# Altium schematic sheet muxduino-shield.SchDoc
size A; SheetNumber: 1; SheetTotal: 1
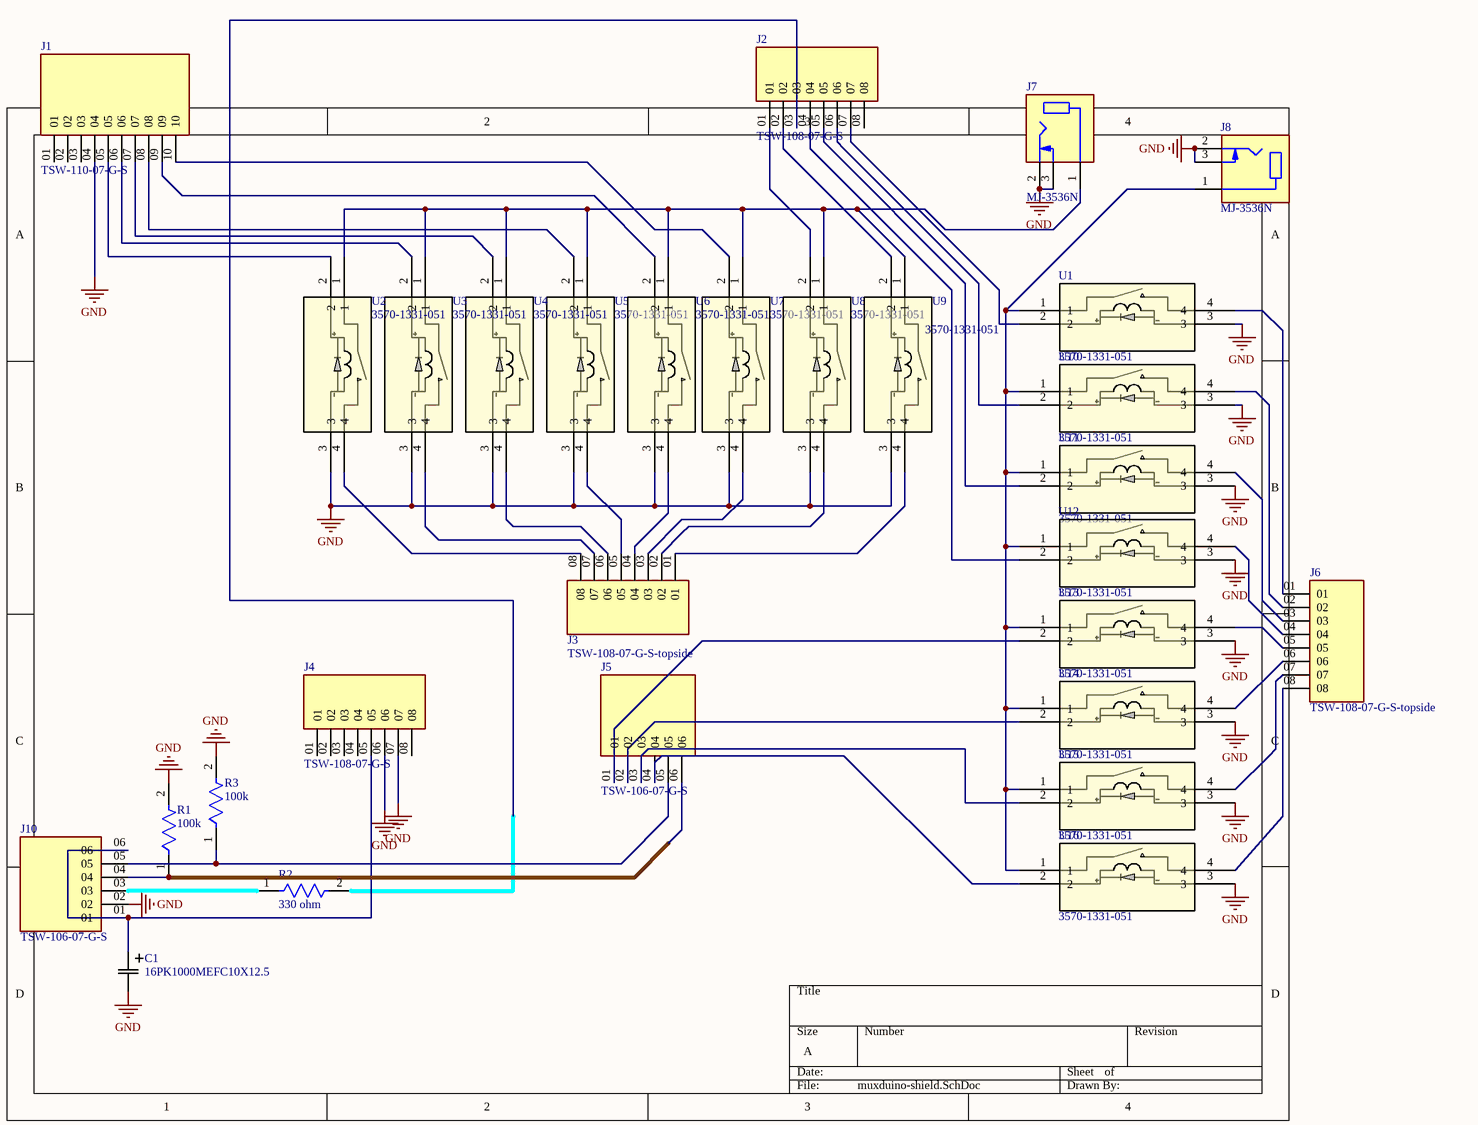
[diagram p0: muxduino-shield.SchDoc]

## Parts
C1  16PK1000MEFC10X12.5  [CAP_PKPZ_10X12P5_LOW_RUB]
J1  TSW-110-07-G-S  [SAMTEC_TSW-110-07-G-S]
J2  TSW-108-07-G-S  [SAMTEC_TSW-108-07-G-S]
J3  TSW-108-07-G-S-topside  [SAMTEC_TSW-108-07-G-S-topside]
J4  TSW-108-07-G-S  [SAMTEC_TSW-108-07-G-S]
J5  TSW-106-07-G-S  [SAMTEC_TSW-106-07-G-S]
J6  TSW-108-07-G-S-topside  [SAMTEC_TSW-108-07-G-S-topside]
J7  MJ-3536N  [CUI_MJ-3536N]
J8  MJ-3536N  [CUI_MJ-3536N]
J10  TSW-106-07-G-S  [SAMTEC_TSW-106-07-G-S]
R1  100k  [FP-RLR07-MFG]
R2  330 ohm  [FP-RLR07-MFG]
R3  100k  [FP-RLR07-MFG]
U1  3570-1331-051  [SIP_3570-1331_COM]
U2  3570-1331-051  [SIP_3570-1331_COM]
U3  3570-1331-051  [SIP_3570-1331_COM]
U4  3570-1331-051  [SIP_3570-1331_COM]
U5  3570-1331-051  [SIP_3570-1331_COM]
U6  3570-1331-051  [SIP_3570-1331_COM]
U7  3570-1331-051  [SIP_3570-1331_COM]
U8  3570-1331-051  [SIP_3570-1331_COM]
U9  3570-1331-051  [SIP_3570-1331_COM]
U10  3570-1331-051  [SIP_3570-1331_COM]
U11  3570-1331-051  [SIP_3570-1331_COM]
U12  3570-1331-051  [SIP_3570-1331_COM]
U13  3570-1331-051  [SIP_3570-1331_COM]
U14  3570-1331-051  [SIP_3570-1331_COM]
U15  3570-1331-051  [SIP_3570-1331_COM]
U16  3570-1331-051  [SIP_3570-1331_COM]

## Nets
GND: C1.2 J1.04 J4.06 J4.07 J7.2 J7.3 J8.2 J8.3 J10.02 R1.2 R3.2 U1.3 U2.3 U3.3 U4.3 U5.3 U6.3 U7.3 U8.3 U9.3 U10.3 U11.3 U12.3 U13.3 U14.3 U15.3 U16.3
NetC1_1: C1.1 J4.05 J10.01 J10.06
NetJ1_05: J1.05 U2.2
NetJ1_06: J1.06 U3.2
NetJ1_07: J1.07 U4.2
NetJ1_08: J1.08 U5.2
NetJ1_09: J1.09 U6.2
NetJ1_10: J1.10 U7.2
NetJ2_01: J2.01 U8.2
NetJ2_02: J2.02 U9.2
NetJ2_03: J2.03 R2.2
NetJ2_04: J2.04 U12.2
NetJ2_05: J2.05 U11.2
NetJ2_06: J2.06 U10.2
NetJ2_07: J2.07 U1.2
NetJ3_01: J3.01 U9.4
NetJ3_02: J3.02 U8.4
NetJ3_03: J3.03 U7.4
NetJ3_04: J3.04 U6.4
NetJ3_05: J3.05 U5.4
NetJ3_06: J3.06 U4.4
NetJ3_07: J3.07 U3.4
NetJ3_08: J3.08 U2.4
NetJ5_01: J5.01 U13.2
NetJ5_02: J5.02 U14.2
NetJ5_03: J5.03 U15.2
NetJ5_04: J5.04 U16.2
NetJ5_05: J5.05 J10.05 R3.1
NetJ5_06: J5.06 J10.04 R1.1
NetJ6_01: J6.01 U1.4
NetJ6_02: J6.02 U10.4
NetJ6_03: J6.03 U11.4
NetJ6_04: J6.04 U12.4
NetJ6_05: J6.05 U13.4
NetJ6_06: J6.06 U14.4
NetJ6_07: J6.07 U15.4
NetJ6_08: J6.08 U16.4
NetJ7_1: J7.1 U2.1 U3.1 U4.1 U5.1 U6.1 U7.1 U8.1 U9.1
NetJ8_1: J8.1 U1.1 U10.1 U11.1 U12.1 U13.1 U14.1 U15.1 U16.1
NetJ10_03: J10.03 R2.1

Not connected (* = marked no-connect by the designer): J1 01 02 03; J2 08; J4 01 02 03 04 08

## Library data of the parts
C1 = 16PK1000MEFC10X12.5: No Description Available; Mfr_Name: Rubycon; Type: DEV; Copyright: Copyright (C) 2024 Ultra Librarian. All rights reserved.; Manufacturer_Part_Number: 16PK1000MEFC10X12.5; RefDes: RefDes
J1 = TSW-110-07-G-S: MF: Samtec Inc.; Package: None; Price: None; Value: *; MP: TSW-110-07-G-S; Availability: Unavailable
J2 J4 = TSW-108-07-G-S: TSW - Samtec 2.54mm Pin Header 10.92mm Overall Pin Length (07) - Fast Stock; MF: Samtec Inc.; SnapEDA_Link: https://www.snapeda.com/parts/TSW-108-07-G-S/Samtec+Inc./view-part/?ref=snap; Package: None; Value: *; MP: TSW-108-07-G-S; Check_prices: https://www.snapeda.com/parts/TSW-108-07-G-S/Samtec+Inc./view-part/?ref=eda
J3 J6 = TSW-108-07-G-S-topside: TSW - Samtec 2.54mm Pin Header 10.92mm Overall Pin Length (07) - Fast Stock; MF: Samtec Inc.; SnapEDA_Link: https://www.snapeda.com/parts/TSW-108-07-G-S/Samtec+Inc./view-part/?ref=snap; Package: None; Value: *; MP: TSW-108-07-G-S; Check_prices: https://www.snapeda.com/parts/TSW-108-07-G-S/Samtec+Inc./view-part/?ref=eda
J5 J10 = TSW-106-07-G-S: MF: Samtec Inc.; Value: *; Availability: Unavailable; Price: None; Package: None; MP: TSW-106-07-G-S
J7 J8 = MJ-3536N: MF: {'manufacturer': u'CUI Devices'}; Package: None; Price: None; Value: *; MP: MJ-3536N; Availability: Unavailable
R1-R3 = CMP-00030-39449004-1: RLR07C1002FSB14 Fixed Resistor, Metal Film, 0.25W, 10000ohm, 250V, 1% +/-Tol, 100ppm/Cel, Through Hole Mount; Power Rating: 250mW; Lead Diameter: 640µm; Wire/Cable Diameter: 50.8µm; Lead Length: 38.1mm; Resistance: 10kΩ; Temperature Coefficient: 100ppm/°C; Military Standard: MIL-PRF-39017; Max Operating Temperature: 150°C; Width: 2.29mm; Mount: Through Hole; Composition: Metal Film; REACH SVHC: Unknown; Tolerance: 1%; Failure Rate: 0.001%; Min Operating Temperature: -65°C; Voltage Rating: 250V; Schedule B: 8533210090, 8533210090; Max Power Dissipation: 250mW; Length: 7.62mm; Case/Package: Conformal; Lead Free: Contains Lead; NexarPartId: 39449004; Radiation Hardening: No; Termination: Axial; Number of Pins: 14; RoHS: Non-Compliant; Packaging: Bulk; Features: Military, Moisture Resistant, Weldable; Number of Terminations: 2; Contact Plating: Lead, Tin; Diameter: 2.29mm; Voltage Rating (DC): 250V
U1-U16 = 3570-1331-051: No Description Available; Mfr_Name: Comus; Copyright: Copyright (C) 2024 Ultra Librarian. All rights reserved.; Manufacturer_Part_Number: 3570-1331-051; RefDes: RefDes; Type: DEV